# Altium schematic sheet Input Filter.SchDoc
size A4
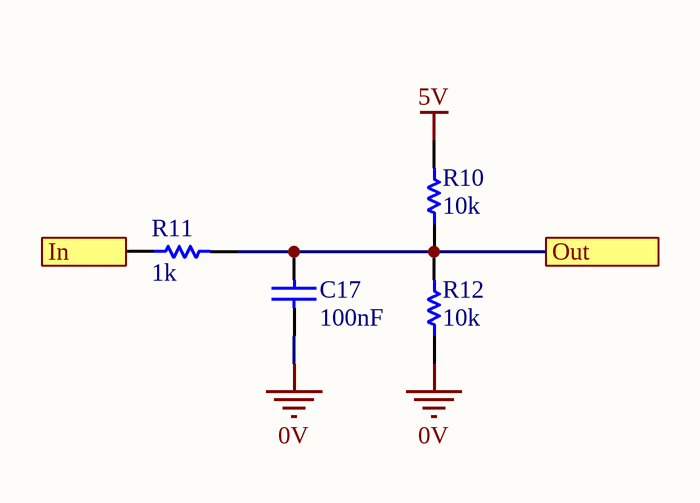
[diagram p0: Input Filter.SchDoc]

## Parts
C17  100nF  [0805]
R10  10k  [0805]
R11  1k  [0805]
R12  10k  [0805]

## Ports
In, Out

## Nets
0V: C17.1 R12.1
5V: R10.2
In: R11.1 ; port In
Out: C17.2 R10.1 R11.2 R12.2 ; port Out

## Library data of the parts
C17 = GCM21BR71E104KA37L: Manufacturer: muRata; Tolerance: 10%; Material: X7R; Rated Voltage: 25V; Part Number: GCM21BR71E104KA37L; Value: 100nF; Digikey Part Number: DO NOT USE FOR NEW DESIGNS
R10 R12 = RC0805FR0710KL: Manufacturer: YAGEO; Tolerance: 0.01; Rated Voltage: 0.125W; Part Number: RC0805FR0710KL; Value: 10k; Material: FR-07; Digikey Part Number: 311-10.0KCRCT-ND
R11 = RC0805FR071KL: Manufacturer: YAGEO; Tolerance: 0.01; Rated Voltage: 0.125W; Part Number: RC0805FR071KL; Value: 1k; Material: FR-07; Digikey Part Number: 311-1.00KCRCT-ND